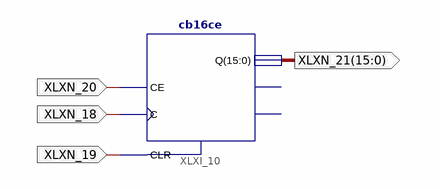
[diagram p0: schematic sheet 1]
// Xilinx ISE schematic main.sch (spartan6) as structural Verilog: 1 symbols, 4 ports
module main (
  input  XLXN_18,
  input  XLXN_19,
  input  XLXN_20,
  output [15:0] XLXN_21
);

  cb16ce XLXI_10 (.C(XLXN_18), .CE(XLXN_20), .CLR(XLXN_19), .Q(XLXN_21));  // open: CEO, TC
endmodule
